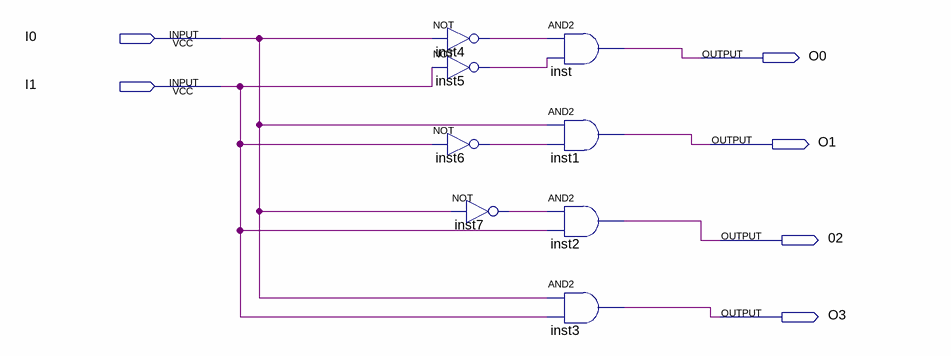
[diagram p0: schematic sheet]
// Quartus schematic decoder_2x4.bdf as structural Verilog: 8 symbols, 6 pins
module decoder_2x4 (
  input  I0,
  input  I1,
  output O0,
  output O1,
  output \02 ,
  output O3
);

  wire inst4_out, inst5_out, inst6_out, inst7_out;

  not inst4 (inst4_out, I0);
  not inst5 (inst5_out, I1);
  not inst6 (inst6_out, I1);
  not inst7 (inst7_out, I0);
  and inst (O0, inst4_out, inst5_out);
  and inst1 (O1, I0, inst6_out);
  and inst2 (\02 , inst7_out, I1);
  and inst3 (O3, I0, I1);
endmodule
